# EAGLE design schemantic (EAGLE 9.5.0)
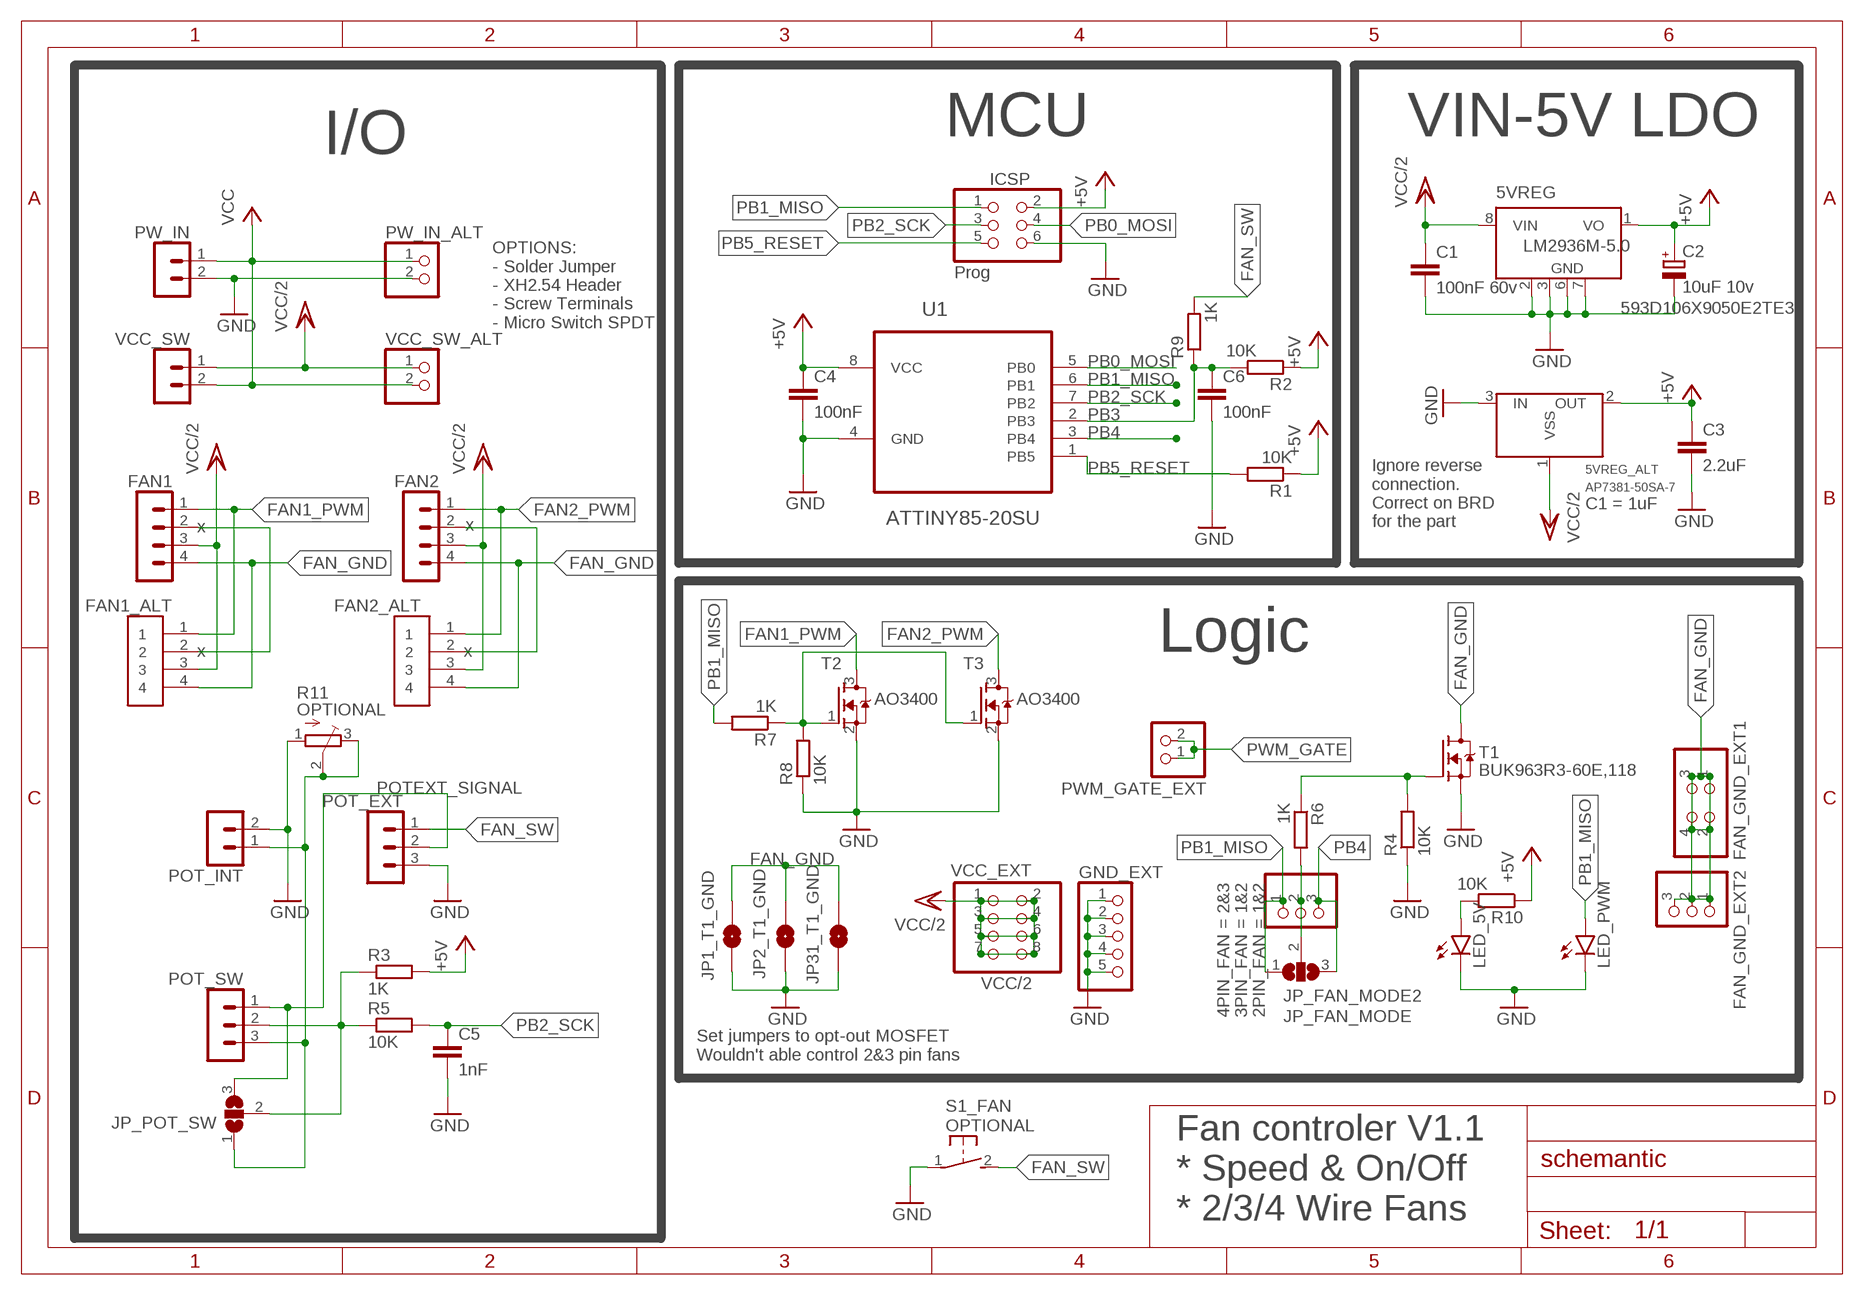
[diagram p0: schematic, sheet 1]

## Parts
5VREG  LM2936M-5.0  [SO08]
5VREG_ALT  AP7381-50SA-7  XC6206SOT-23  [XC6206_SOT-23]
C1  100nF 60v  C-EUC1206  [C1206]
C2  10uF 10v  CPOL-EUSMCE  [SMC_E]
C3  2.2uF  C-EUC0805  [C0805]
C4  100nF  C-EUC0805  [C0805]
C5  1nF  C-EUC0805  [C0805]
C6  100nF  C-EUC0805  [C0805]
FAN1  FAN1  B4P-VH  [B4P-VH]
FAN1_ALT  1X4-BIG  [1X04-BIG]
FAN2  FAN1  B4P-VH  [B4P-VH]
FAN2_ALT  1X4-BIG  [1X04-BIG]
FAN_GND_EXT1  PINHD-2X2  [2X02]
FAN_GND_EXT2  PINHD-1X3  [1X03]
GND_EXT  PINHD-1X5  [1X05]
ICSP  Prog  PINHD-2X3  [2X03]
JP1_T1_GND  JUMPER-SMT_2_NO_NO-SILK  [SMT-JUMPER_2_NO_NO-SILK]
JP2_T1_GND  JUMPER-SMT_2_NO_NO-SILK  [SMT-JUMPER_2_NO_NO-SILK]
JP31_T1_GND  JUMPER-SMT_2_NO_NO-SILK  [SMT-JUMPER_2_NO_NO-SILK]
JP_FAN_MODE  DC_COM_PWM  SJ2W  [SJ_2]
JP_FAN_MODE2  PINHD-1X3  [1X03]
JP_POT_SW  SJ2W  [SJ_2]
LED_5V  LEDCHIPLED_0805  [CHIPLED_0805]
LED_PWM  LEDCHIPLED_0805  [CHIPLED_0805]
POT_EXT  POT_EXT  B3B-XH-2  [B3B-XH-A]
POT_INT  POT_INT  B2B-XH-2  [B2B-XH-A]
POT_SW  POT_SW  B3B-XH-2  [B3B-XH-A]
PW_IN  Power In  B2P-VH  [B2P-VH]
PW_IN_ALT  PINHD-1X2  [1X02]
PWM_GATE_EXT  PINHD-1X2  [1X02]
R1  10K  R-EU_R0805  [R0805]
R2  10K  R-EU_R0805  [R0805]
R3  1K  R-EU_R0805  [R0805]
R4  10K  R-EU_R0805  [R0805]
R5  10K  R-EU_R0805  [R0805]
R6  1K  R-EU_R0805  [R0805]
R7  1K  R-EU_R0805  [R0805]
R8  10K  R-EU_R0805  [R0805]
R9  1K  R-EU_R0805  [R0805]
R10  10K  R-EU_R0805  [R0805]
R11  TRIM_EU-3223W  [3223W]
S1_FAN  DTSM-3  [DTSM-3]
T1  BUK963R3-60E,118  MOSFET-N-D2PAK  [D2PAK_TO263]
T2  AO3400  MOSFET-NREFLOW  [SOT23]
T3  AO3400  MOSFET-NREFLOW  [SOT23]
U1  ATTINY85-20SU  [SOIC127P798X216-8N]
VCC_EXT  PINHD-2X4  [2X04]
VCC_SW  Power SW  B2P-VH  [B2P-VH]
VCC_SW_ALT  PINHD-1X2  [1X02]

## Nets
+5V: 5VREG.1(VO) 5VREG_ALT.2(OUT) C2.+ C3.1 C4.1 ICSP.2 R1.1 R2.1 R3.2 R10.1 U1.8(VCC)
FAN1_LATCH: FAN1.2 FAN1_ALT.2
FAN1_PWM: FAN1.1 FAN1_ALT.1 T2.3(D)
FAN2_LATCH: FAN2.2 FAN2_ALT.2
FAN2_PWM: FAN2.1 FAN2_ALT.1 T3.3(D)
FAN_GND: FAN1.4 FAN1_ALT.4 FAN2.4 FAN2_ALT.4 FAN_GND_EXT1.1 FAN_GND_EXT1.2 FAN_GND_EXT1.3 FAN_GND_EXT1.4 FAN_GND_EXT2.1 FAN_GND_EXT2.2 FAN_GND_EXT2.3 JP1_T1_GND.2 JP2_T1_GND.2 JP31_T1_GND.2 T1.2(D)
FAN_SW: POT_EXT.1 R9.2 S1_FAN.2
GND: 5VREG.2(GND) 5VREG.3(GND) 5VREG.6(GND) 5VREG.7(GND) 5VREG_ALT.3(IN) C1.2 C2.- C3.2 C4.2 C5.2 C6.2 GND_EXT.1 GND_EXT.2 GND_EXT.3 GND_EXT.4 GND_EXT.5 ICSP.6 JP1_T1_GND.1 JP2_T1_GND.1 JP31_T1_GND.1 LED_5V.C LED_PWM.C POT_EXT.3 POT_INT.2 PW_IN.2 PW_IN_ALT.2 R4.1 R8.1 R11.1(A) S1_FAN.1 T1.3(S) T2.2(S) T3.2(S) U1.4(GND)
JP1_COM: JP_FAN_MODE2.2 JP_FAN_MODE.2 R6.2
LED1_ANODE: LED_5V.A R10.2
PB0_MOSI: ICSP.4 U1.5(PB0)
PB1_MISO: ICSP.1 JP_FAN_MODE2.1 JP_FAN_MODE.1 LED_PWM.A R7.2 U1.6(PB1)
PB2_SCK: C5.1 ICSP.3 R5.2 U1.7(PB2)
PB3: C6.1 R2.2 R9.1 U1.2(PB3)
PB4: JP_FAN_MODE2.3 JP_FAN_MODE.3 U1.3(PB4)
PB5_RESET: ICSP.5 R1.2 U1.1(PB5)
POTEXT_SIGNAL: JP_POT_SW.3 POT_EXT.2 POT_SW.1
POTINT_SIGNAL: JP_POT_SW.1 POT_INT.1 POT_SW.3 R11.2(S) R11.3(E)
POTSW_COM: JP_POT_SW.2 POT_SW.2 R3.1 R5.1
PWM_GATE: PWM_GATE_EXT.1 PWM_GATE_EXT.2 R7.1 R8.2 T2.1(G) T3.1(G)
T1_GATE: R4.2 R6.1 T1.1(G)
VCC: PW_IN.1 PW_IN_ALT.1 VCC_SW.2 VCC_SW_ALT.2
VCC/2: 5VREG.8(VIN) 5VREG_ALT.1(VSS) C1.1 FAN1.3 FAN1_ALT.3 FAN2.3 FAN2_ALT.3 VCC_EXT.1 VCC_EXT.2 VCC_EXT.3 VCC_EXT.4 VCC_EXT.5 VCC_EXT.6 VCC_EXT.7 VCC_EXT.8 VCC_SW.1 VCC_SW_ALT.1

## Notes on the sheet
- I/O | MCU | VIN-5V LDO
- OPTIONS:
  - Solder Jumper
  - XH2.54 Header
  - Screw Terminals
  - Micro Switch SPDT
- Ignore reverse
  connection.
  Correct on BRD
  for the part
- x | x
- Logic
- x | x
- Set jumpers to opt-out MOSFET
  Wouldn't able control 2&3 pin fans
- Fan controler V1.1
  * Speed & On/Off
  * 2/3/4 Wire Fans

## Library data of the parts
5VREG = national-semiconductor:LM2936M?*: Ultra-Low Quiescent Current LDO Voltage Regulator Source: Data sheet <http://www.national.com/ds/LM/LM2936.pdf>; MF: NATIONAL SEMICONDUCTOR; MPN: LM2936HVMA-5.0/NOPB; OC_FARNELL: 9494421; OC_NEWARK: 41K4515
5VREG_ALT = Voltage Regulator:XC6206: XC6206P , linear regulator. Producted by TOREX.Co Store Information: EXCEL device corporation http://www.excel-d.com/access/index.html; C1: 1uF
C1 C3-C6 = rcl:C-EU: CAPACITOR, European symbol; SPICEPREFIX: C
C2 = rcl:CPOL-EU: POLARIZED CAPACITOR, European symbol; MODEL: 593D106X9050E2TE3; SPICEPREFIX: C
FAN1 FAN2 = con-jst-vh:B4P-VH: JST VH Series header 3.96mm pitch disconnectable crimp style connectors, vertical (side entry type), 4 pins
FAN1_ALT FAN2_ALT = adafruit:1X4: 4-pin connector
FAN_GND_EXT1 = pinhead:PINHD-2X2: PIN HEADER
FAN_GND_EXT2 = pinhead:PINHD-1X3: PIN HEADER
GND_EXT = pinhead:PINHD-1X5: PIN HEADER
ICSP = pinhead:PINHD-2X3: PIN HEADER
JP1_T1_GND JP2_T1_GND JP31_T1_GND = SparkFun-Jumpers:JUMPER-SMT_2_NO: Normally open jumper This jumper has two pads in close proximity to each other. Apply solder to close the connection. Round pads are easier to solder for beginners, but are a lot larger. SparkFun Product that uses the round pads: SparkFun EL Sequencer <https://www.sparkfun.com/products/12781>
JP_FAN_MODE JP_POT_SW = jumper:SJ2W: SMD solder JUMPER
JP_FAN_MODE2 = adafruit:PINHD-1X3: PIN HEADER; 2PIN_FAN: 1&2; 3PIN_FAN: 1&2; 4PIN_FAN: 2&3
LED_5V LED_PWM = led:LED: LED OSRAM: - CHIPLED LG R971, LG N971, LY N971, LG Q971, LY Q971, LO R971, LY R971 LH N974, LH R974 LS Q976, LO Q976, LY Q976 LO Q996 - Hyper CHIPLED LW Q18S LB Q993, LB Q99A, LB R99A - SideLED LS A670, LO A670, LY A670, LG A670, LP A670 LB A673, LV A673, LT A673, LW A673 LH A674 LY A675 LS A676, LA A676, LO A676, LY A676, LW A676 LS A679, LY A679, LG A679 - Hyper Micro SIDELED® LS Y876, LA Y876, LO Y876, LY Y876 LT Y87S - SmartLED LW L88C, LW L88S LB L89C, LB L89S, LG L890 LS L89K, LO L89K, LY L89K LS L896, LA L896, LO L896, LY L896 - TOPLED LS T670, LO T670, LY T670, LG T670, LP T670 LSG T670, LSP T670, LSY T670, LOP T670, LYG T670 LG T671, LOG T671, LSG T671 LB T673, LV T673, LT T673, LW T673 LH T674 LS T676, LA T676, LO T676, LY T676, LB T676, LH T676, LSB T676, LW T676 LB T67C, LV T67C, LT T67C, LS T67K, LO T67K, LY T67K, LW E67C LS E67B, LA E67B, LO E67B, LY E67B, LB E67C, LV E67C, LT E67C LW T67C LS T679, LY T679, LG T679 LS T770, LO T770, LY T770, LG T770, LP T770 LB T773, LV T773, LT T773, LW T773 LH T774 LS E675, LA E675, LY E675, LS T675 LS T776, LA T776, LO T776, LY T776, LB T776 LHGB T686 LT T68C, LB T68C - Hyper Mini TOPLED® LB M676 - Mini TOPLED Santana® LG M470 LS M47K, LO M47K, LY M47K Source: http://www.osram.convergy.de LUXEON: - LUMILED® LXK2-PW12-R00, LXK2-PW12-S00, LXK2-PW14-U00, LXK2-PW14-V00 LXK2-PM12-R00, LXK2-PM12-S00, LXK2-PM14-U00 LXK2-PE12-Q00, LXK2-PE12-R00, LXK2-PE12-S00, LXK2-PE14-T00, LXK2-PE14-U00 LXK2-PB12-K00, LXK2-PB12-L00, LXK2-PB12-M00, LXK2-PB14-N00, LXK2-PB14-P00, LXK2-PB14-Q00 LXK2-PR12-L00, LXK2-PR12-M00, LXK2-PR14-Q00, LXK2-PR14-R00 LXK2-PD12-Q00, LXK2-PD12-R00, LXK2-PD12-S00 LXK2-PH12-R00, LXK2-PH12-S00 LXK2-PL12-P00, LXK2-PL12-Q00, LXK2-PL12-R00 Source: www.luxeon.com KINGBRIGHT: KA-3528ASYC Source: www.kingbright.com
POT_EXT POT_SW = con-jst-xh:B3B-XH: JST XH series header 2.50mm pitch disconnectable crimp style connectors, vertical (side entry type), 3 pins
POT_INT = con-jst-xh:B2B-XH: JST XH series header 2.50mm pitch disconnectable crimp style connectors, vertical (side entry type), 2 pins
PW_IN VCC_SW = con-jst-vh:B2P-VH: JST VH Series header 3.96mm pitch disconnectable crimp style connectors, vertical (side entry type), 2 pins
PW_IN_ALT PWM_GATE_EXT VCC_SW_ALT = pinhead:PINHD-1X2: PIN HEADER
R1-R10 = rcl:R-EU_: RESISTOR, European symbol; SPICEPREFIX: R
R11 = pot:TRIM_EU-: POTENTIOMETER; OPTIONAL: YES
S1_FAN = switch-tact:DTSM-3; OPTIONAL: YES
T1 = we-transistor:MOSFET-N: N-Channel MOSFET SOT23 N-Chn MOSFET TSM3404, TSM240N03 (Vgs>=+/-20V, Vds<=30V, Id>=3A + Rds<=0.05Ohm @ Vgs=4.5V) BSS138 (Vgs>=+/-20V, Vds<=40V, Id>=0.2A + Rds<=3Ohm @ Vgs=4.5V) SOT223 Low Side Switch with Protection (Infineon) BSP76 (Vin=0...10V, Vds<=42V, Id=1.4A + Rds=0.2Ohm @ Vin=5V) BSP77 (Vin=0...10V, Vds<=42V, Id=2.2A + Rds=0.1Ohm @ Vin=5V) D²Pak Low Side Switch with Protection (Infineon) BTS117TC (Vin=0...10V, Vds<=60V, Id=3.5A + Rds=0.12Ohm @ Vin=5V) BTS133TC (Vin=0...10V, Vds<=60V, Id=7A + Rds=0.06Ohm @ Vin=5V) BTS141TC (Vin=0...10V, Vds<=60V, Id=12A + Rds=0.03Ohm @ Vin=5V) BTS3018TC (Vin=0...10V, Vds<=60V, Id=6A + Rds=0.02Ohm @ Vin=5V); ALT1: IRF2805SPbF; OLD: SQM110P06-8m9L_GE3
T2 T3 = adafruit:MOSFET-N: N-Channel Mosfet 2N7002E - 60V 260mA SOT23 [Digikey: 2N7002ET1GOSTR-ND] - REEL BSH103 - 30V 850mA SOT23 [Digikey: 568-5013-1-ND]; SPICEPREFIX: J
U1 = Atmel_By_element14_Batch_1-00:ATTINY85-20SU: 8-bit Microcontroller with In-System Programmable Flash; MPN: ATTINY85-20SU; OC_FARNELL: 1455164; OC_NEWARK: 58M3797; PACKAGE: SOIC-8; SUPPLIER: Atmel
VCC_EXT = pinhead:PINHD-2X4: PIN HEADER

## Board
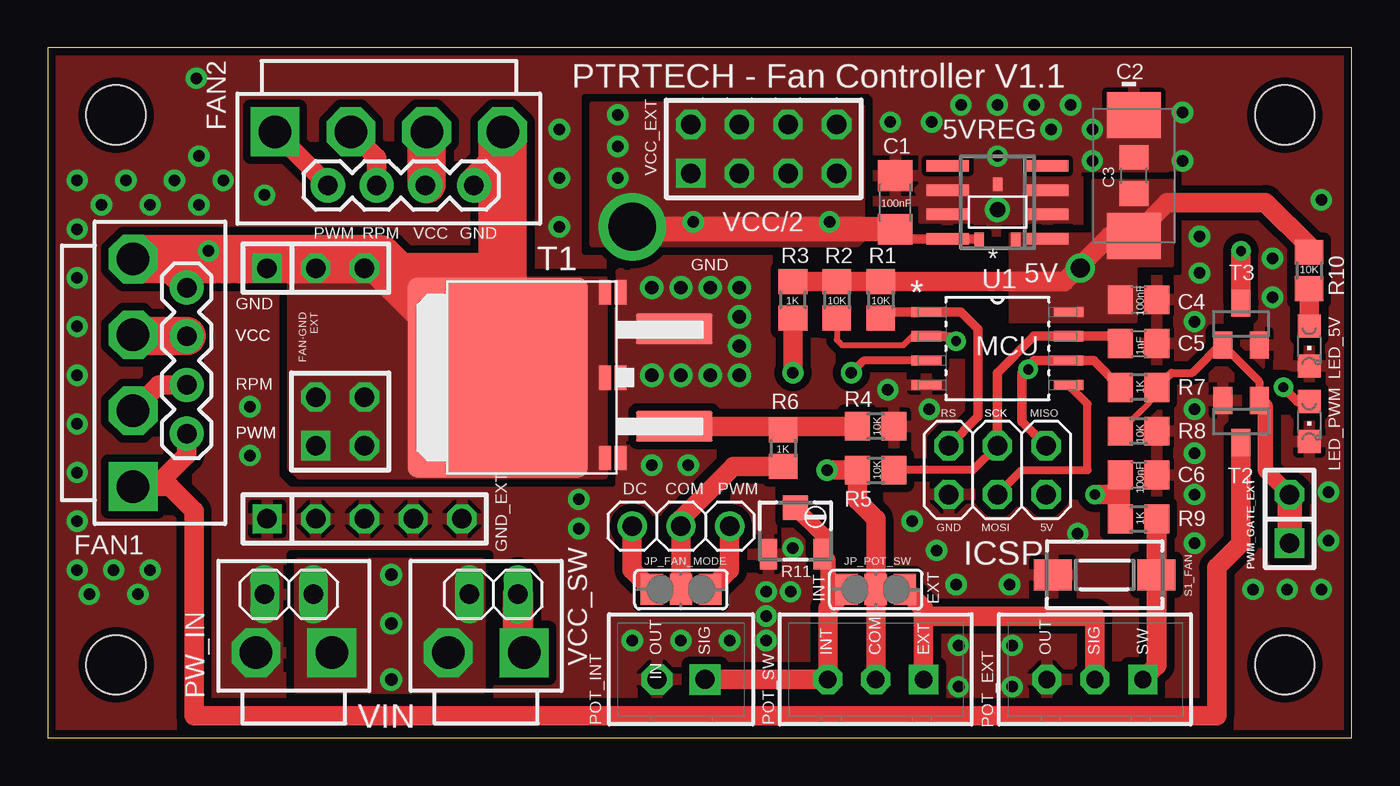
[diagram p1: board, top side]
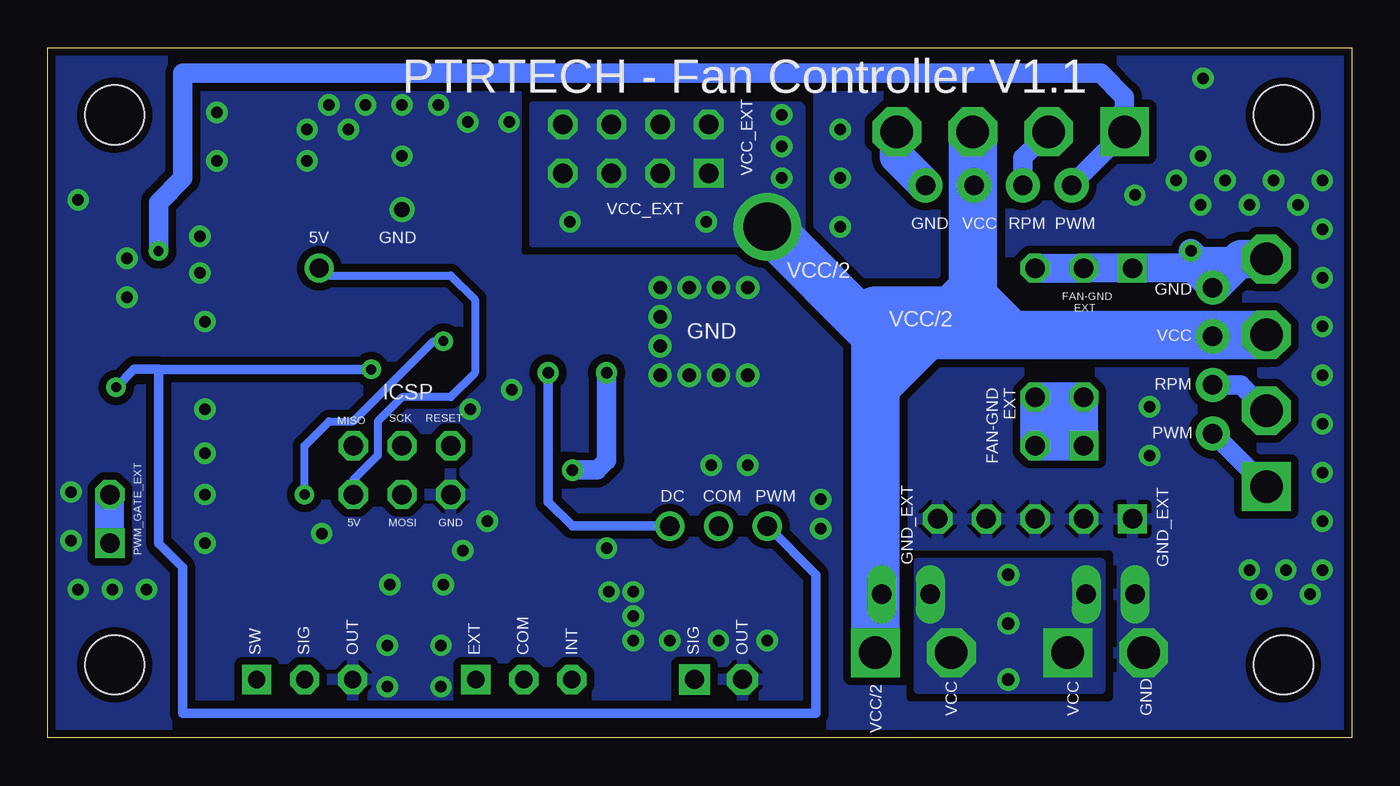
[diagram p2: board, bottom side, seen from below]

Size 68 x 36 mm. Coordinates in mm from the lower left corner, seen from the top.
Outline: 0,0 68,0 68,36 0,36 0,0
Copper layers (1*16): Top 0.035mm / dielectric 1.5mm / Bottom 0.035mm
Design rules "SparkFun-2-layer-STANDARD": minimum track width 10mil, minimum drill 20mil, track to track 10mil, track to pad 8mil, pad to pad 8mil, via to via 10mil, smd to smd 8mil, copper to edge 8mil, drill to drill 8mil, minimum pad ring 10mil, minimum via ring 10mil, stop-mask expansion 4mil, vias tented up to drill 25mil, thermal gap 10mil
Holes 3.1 mm at 3.56,3.81 3.56,32.5 64.52,3.81 64.52,32.5

### Footprints (pad centres in the part's own frame; a part is rotated, then mirrored left to right if it is on the bottom)
SO08 = smd 0.6 x 2.2: 1 -1.905,-2.6; 2 -0.635,-2.6; 3 0.635,-2.6; 4 1.905,-2.6; 5 1.905,2.6; 6 0.635,2.6; 7 -0.635,2.6; 8 -1.905,2.6
XC6206_SOT-23 = smd 0.5 x 0.7: 1 -0.95,-1.415; 2 0.95,-1.415; 3 0,1.44
C1206 = smd 1.6 x 1.8: 1 -1.4,0; 2 1.4,0
SMC_E = smd 2.4 x 2.8: + -3.15,0; - 3.15,0
C0805 = smd 1.3 x 1.5: 1 -0.95,0; 2 0.95,0
B4P-VH = drill 1.7 pad 2.54 square: 1 -5.94,0 | drill 1.7 pad 2.54 octagon: 2 -1.98,0; 3 1.98,0; 4 5.94,0
1X04-BIG = drill 1.016 pad 1.778: 1 0,0; 2 2.54,0; 3 5.08,0; 4 7.62,0
2X02 = drill 1.016 square: 1 -1.27,-1.27 | drill 1.016 octagon: 2 -1.27,1.27; 3 1.27,-1.27; 4 1.27,1.27
1X03 = drill 1.016 square: 1 -2.54,0 | drill 1.016 octagon: 2 0,0; 3 2.54,0
1X05 = drill 1.016 square: 1 -5.08,0 | drill 1.016 octagon: 2 -2.54,0; 3 0,0; 4 2.54,0; 5 5.08,0
2X03 = drill 1.016 octagon: 1 -2.54,-1.27; 2 -2.54,1.27; 3 0,-1.27; 4 0,1.27; 5 2.54,-1.27; 6 2.54,1.27
SMT-JUMPER_2_NO_NO-SILK = smd 0.635 x 1.27: 1 -0.406,0; 2 0.406,0
SJ_2 = smd 1.168 x 1.6: 1 -1.524,0; 2 0,0; 3 1.524,0
1X03' = drill 1.016: 1 -2.54,0; 2 0,0; 3 2.54,0
CHIPLED_0805 = smd 1.2 x 1.2: A 0,-1.05; C 0,1.05
B3B-XH-A = drill 0.9 pad 1.524 square: 1 2.5,0 | drill 0.9 pad 1.524 octagon: 2 0,0; 3 -2.5,0
B2B-XH-A = drill 1 pad 1.6 square: 1 1.25,0 | drill 1 pad 1.6 octagon: 2 -1.25,0
B2P-VH = drill 1.7 pad 2.54 square: 1 -1.98,0 | drill 1.7 pad 2.54 octagon: 2 1.98,0
1X02 = drill 1.016 long: 1 -1.27,0; 2 1.27,0
1X02' = drill 1.016 square: 1 -1.27,0 | drill 1.016 octagon: 2 1.27,0
R0805 = smd 1.3 x 1.5: 1 -0.95,0; 2 0.95,0
3223W = smd 0.9 x 1.6: 1 -1.4,-1.215; 3 1.4,-1.215 | smd 1.3 x 1.3: 2 0,1.215
DTSM-3 = smd 2 x 1.6: 1 -2.7,0; 2 2.7,0
D2PAK_TO263 = smd 4 x 1.6: 1 -6,2.54; 3 -6,-2.54 | smd 9.4 x 10.4: 2 3.2,0
SOT23 = smd 1 x 1.4: 1 -0.95,-1.1; 2 0.95,-1.1; 3 0,1.1
SOIC127P798X216-8N = smd 1.549 x 0.533: 1 -3.708,1.905; 2 -3.708,0.635; 3 -3.708,-0.635; 4 -3.708,-1.905; 5 3.708,-1.905; 6 3.708,-0.635; 7 3.708,0.635; 8 3.708,1.905
2X04 = drill 1.016 square: 1 -3.81,-1.27 | drill 1.016 octagon: 2 -3.81,1.27; 3 -1.27,-1.27; 4 -1.27,1.27; 5 1.27,-1.27; 6 1.27,1.27; 7 3.81,-1.27; 8 3.81,1.27

### Placement (x,y rotation side)
5VREG  49.53,27.94 90 top
5VREG_ALT  49.53,27.43 0 top
C1  44.2,27.94 90 top
C2  56.64,29.34 90 top
C3  56.64,29.34 90 top
C4  56.9,22.86 0 top
C5  56.9,20.57 0 top
C6  56.9,13.72 0 top
FAN1  4.45,19.05 90 top
FAN1_ALT  7.24,15.88 90 top
FAN2  17.78,31.62 0 top
FAN2_ALT  14.61,28.83 0 top
FAN_GND_EXT1  15.24,16.51 0 top
FAN_GND_EXT2  13.97,24.51 0 top
GND_EXT  16.51,11.43 0 top
ICSP  49.53,13.97 180 top
JP1_T1_GND  29.46,18.8 180 top
JP2_T1_GND  29.46,14.61 180 top
JP31_T1_GND  29.46,23.24 180 top
JP_FAN_MODE  33.02,7.75 0 top
JP_FAN_MODE2  [1X03']  33.02,11.05 0 top
JP_POT_SW  43.18,7.75 0 top
LED_5V  65.79,20.45 180 top
LED_PWM  65.79,16.51 180 top
POT_EXT  54.61,3.05 0 top
POT_INT  33.02,3.05 0 top
POT_SW  43.18,3.05 0 top
PW_IN  12.83,4.45 180 top
PW_IN_ALT  12.57,7.49 180 top
PWM_GATE_EXT  [1X02']  64.77,11.43 90 top
R1  43.43,22.86 270 top
R2  41.15,22.86 270 top
R3  38.86,22.86 90 top
R4  43.18,16.26 180 top
R5  43.18,13.97 0 top
R6  38.35,15.11 270 top
R7  56.9,18.29 180 top
R8  56.9,16 180 top
R9  56.9,11.43 0 top
R10  65.79,24.38 270 top
R11  38.99,10.79 0 top
S1_FAN  55.12,8.51 0 top
T1  26.67,18.8 180 top
T2  62.23,16.51 180 top
T3  62.23,21.59 0 top
U1  49.53,20.32 0 top
VCC_EXT  37.34,30.73 0 top
VCC_SW  22.86,4.45 180 top
VCC_SW_ALT  23.24,7.49 180 top

### Tracks (layer width: path | path; a pad name or v marks a point on that pad's centre or on a via)
+5V  (via drill 1)
  Top 1.016: R1.1 53.02,23.81 55.4,26.19 C2.+ 58.4,27.94 63.5,27.94 65.79,25.65 R10.1 | R3.2 R1.1 | R2.1 R1.1
  Bottom 0.406: ICSP.2 52.07,13.46 50.8,14.73 50.8,16.51 49.53,17.78 46.99,17.78 45.72,19.05 45.72,22.86 46.99,24.13 53.47,24.13
  Bottom 0.508: v53.85,24.51 53.47,24.13
  pour Top (rank 5, no thermals): 56.77,21.72 56.77,24.64 58.67,24.64 58.67,29.08 54.48,29.08 54.48,26.29 50.16,26.29 50.16,21.72
FAN1_LATCH
  Top 1.016: FAN1.2 5.79,18.41 FAN1_ALT.2
  Bottom 1.016: FAN1.2 5.79,18.41 FAN1_ALT.2
FAN1_PWM
  Top 1.016: 5.59,13.11 6.35,13.11 7.62,11.84 7.62,1.14 60.96,1.14 60.96,8.89 62.23,10.16 T2.3 | 5.59,13.11 FAN1.1 | FAN1_ALT.1 7.24,14.76 5.59,13.11
  Bottom 1.016: FAN1.1 7.21,15.88 FAN1_ALT.1
FAN2_LATCH
  Top 1.016: FAN2_ALT.2 17.14,30.28 FAN2.2
  Bottom 1.016: FAN2.2 17.14,30.28 FAN2_ALT.2
FAN2_PWM  (via drill 0.51)
  Top 1.016: T3.3 v62.23,25.4 | FAN2_ALT.1 11.84,31.59 FAN2.1
  Bottom 1.016: v62.23,25.4 62.23,27.94 60.96,29.21 60.96,34.67 13.08,34.67 11.84,33.43 FAN2.1 11.84,31.59 FAN2_ALT.1
FAN_GND  (via drill 0.6)
  Top 1.27: FAN1_ALT.4 5.74,24.99 FAN1.4
  Top 1.8: FAN2_ALT.4 23.72,30.32 FAN2.4
  Top 2: 17.96,24.31 23.54,24.31 23.72,24.13
  Top 2.54: 22.45,19.82 T1.2 | T1.2 17.96,24.31 17.28,24.99 14.85,24.99 14.83,24.97 | 14.83,24.97 8.89,24.97 8.87,24.99 FAN1.4 14.81,24.99 14.83,24.97 | T1.2 23.72,19.05 23.72,24.13 FAN2.4
  Bottom 1.016: v8.38,25.4 8.38,24.64 8.26,24.51
  Bottom 1.27: FAN1.4 7.97,24.99 v8.38,25.4
  Bottom 1.5: FAN_GND_EXT2.3 FAN_GND_EXT2.2 FAN_GND_EXT2.1 8.26,24.51 FAN1_ALT.4 | FAN_GND_EXT1.2 FAN_GND_EXT1.4 FAN_GND_EXT1.3 | FAN_GND_EXT1.3 FAN_GND_EXT1.1 FAN_GND_EXT1.2 | FAN_GND_EXT1.2 FAN_GND_EXT1.3
  Bottom 1.8: FAN1_ALT.4 5.74,24.99 | FAN2_ALT.4 23.72,30.32 FAN2.4
  Bottom 2: 5.74,24.99 FAN1.4
  pour Top (isolate 0.305, rank 5, no thermals): 12.57,24 29.08,24 29.08,13.59 13.08,13.59 12.57,14.1
FAN_SW
  Top 1.016: R9.2 57.85,3.78 POT_EXT.1 57.82,3.76 S1_FAN.2 57.82,11.4 R9.2
GND  (via drill 0.6, 0.7, 0.8)
  other vias: 45.09,11.3 43.81,18.16 49.53,27.56 26.67,31.75 43.94,32.13 30.48,5.08 33.02,5.08 36.07,21.97 1.52,13.84 59.82,12.7 59.82,21.72 59.82,10.16 59.82,14.86 52.32,31.75 54.48,30.1 59.18,30.1 45.97,17.14 35.56,5.08 37.47,5.08 1.52,16.38 1.52,18.92 1.52,21.46 1.52,24 47.5,2.67 59.82,17.14 53.72,10.67 46.35,9.78 1.52,26.54 1.52,29.08 4.06,29.08 6.6,29.08 1.52,11.3 1.52,8.76 5.33,8.76 49.53,30.35 60.07,24.26 26.67,29.21 9.14,29.08 7.87,27.81 5.33,27.81 2.79,27.81 33.02,18.92 31.5,18.92 34.54,18.92 7.87,30.35 10.54,17.27 10.54,14.73 59.18,32.64 63.88,22.99 63.88,25.02 66.8,12.83 66.8,10.29 66.42,7.75 62.87,7.75 66.42,28.07 60.07,26.16 26.67,26.67 46.1,32.13 11.3,28.32 36.07,18.92 31.5,23.5 33.02,23.5 34.54,23.5 36.07,23.5 36.07,20.45 50.16,8 47.37,8 47.5,4.83 50.29,4.83 50.29,2.67 27.69,10.92 31.5,14.22 33.4,14.22 27.69,12.45 37.47,6.35 37.47,7.62 38.73,7.62 38.86,9.91 7.75,34.42 3.43,8.76 64.64,7.75 2.16,7.49 4.7,7.49 47.62,33.02 51.44,33.02 49.53,33.02 53.34,33.02 54.48,31.75
  pour Top (isolate 0.406, rank 6): -0.64,36.83 68.71,36.83 68.71,-0.89 -0.64,-0.89
  pour Bottom (isolate 0.406, rank 6): -1.65,37.97 69.85,37.97 69.85,-2.03 -1.65,-2.03
  pour Top (rank 5, no thermals): 45.47,32.26 45.47,26.92 53.85,26.92 53.85,29.59 58.42,29.59 58.42,32.26
  pour Top (no thermals): 9.02,9.14 12.06,9.14 12.06,2.54 9.02,2.54
  pour Bottom (no thermals): 9.02,9.14 12.06,9.14 12.06,2.54 9.02,2.54
  pour Top (no thermals): 29.84,24.13 36.83,24.13 36.83,17.91 29.84,17.91
  pour Top (isolate 0.406, no thermals): 29.72,13.72 29.72,15.11 31.62,15.11 31.62,13.72
JP1_COM
  Top 1.016: JP_FAN_MODE.2 JP_FAN_MODE2.2 33.02,11.43 35.75,14.16 R6.2
LED1_ANODE
  Top 1.016: R10.2 LED_5V.A
PB0_MOSI
  Top 0.406: ICSP.4 50.8,13.97 54.23,13.97 54.23,17.42 U1.5
PB1_MISO  (via drill 0.51)
  Top 0.406: U1.6 51.6,19.68 v51.14,19.22
  Top 0.508: R7.2 54.55,19.68 U1.6 51.44,19.68 50.8,19.05 50.8,16.51 ICSP.1 | LED_PWM.A 65.17,17.56 v64.44,18.29
  Top 1.016: JP_FAN_MODE.1 30.48,8.76 JP_FAN_MODE2.1
  Bottom 0.508: 62.23,19.24 62.23,10.16 60.96,8.89 60.96,1.27 27.94,1.27 27.94,8.51 JP_FAN_MODE2.1 | v51.14,19.22 62.21,19.22 62.23,19.24 | 62.23,19.24 63.49,19.24 v64.44,18.29
PB2_SCK
  Top 0.406: ICSP.3 48.26,13.97 R5.2
  Top 0.508: ICSP.3 49.53,19.05 51.44,20.95 U1.7 55.56,20.95 C5.1
PB3  (via drill 0.51)
  Top 0.305: R2.2 41.15,20.77 41.44,20.47 44.6,20.47 45.09,20.95 U1.2
  Top 0.406: U1.2 47.12,20.95 v47.37,20.7
  Top 1.016: C6.1 55.95,12.7 | 55.95,12.7 R9.1 | v54.61,12.7 55.95,12.7
  Bottom 0.406: v47.37,20.7 47.88,20.7 52.07,16.51 53.34,16.51 54.61,15.24 v54.61,12.7
PB4  (via drill 0.6)
  Top 0.406: U1.3 42.55,19.68 v41.91,19.05
  Top 1.016: JP_FAN_MODE2.3 35.56,8.76 JP_FAN_MODE.3
  Bottom 0.508: v41.91,19.05 41.91,12.32 40.64,11.05 JP_FAN_MODE2.3
PB5_RESET
  Top 0.508: R1.2 43.75,22.23 U1.1 47.62,22.23 48.51,21.34 48.51,16.76 ICSP.5
POTEXT_SIGNAL
  Top 1.016: JP_POT_SW.3 45.68,6.77 45.68,6.35 | 45.68,6.35 POT_SW.1 | POT_EXT.2 54.61,6.35 45.68,6.35
POTINT_SIGNAL
  Top 0.813: R11.2 40.39,10.61 R11.3 40.68,9.29 40.68,6.35
  Top 1.016: JP_POT_SW.1 40.68,6.77 40.68,6.35 POT_SW.3 POT_INT.1
POTSW_COM  (via drill 0.6)
  Top 1.016: R3.1 v38.86,19.05 | v40.64,13.97 R5.1 42.23,12.38 43.18,11.43 JP_POT_SW.2 POT_SW.2
  Bottom 1.016: v38.86,19.05 38.86,14.48 39.37,13.97 v40.64,13.97
PWM_GATE
  Top 0.305: 57.88,18.32 57.88,17.93 57.05,17.11 56.84,16.9 R8.2
  Top 0.406: T2.1 63.18,18.59 T3.1 61.32,20.49 61.32,20.68 59.69,19.05 58.61,19.05 57.88,18.32 R7.1
  Top 0.813: PWM_GATE_EXT.2 63.5,13.97 63.5,17.29 T2.1
  Top 1.27: PWM_GATE_EXT.1 PWM_GATE_EXT.2
  Bottom 1.5: PWM_GATE_EXT.1 PWM_GATE_EXT.2
T1_GATE
  Top 1.016: 38.35,16.26 T1.1 | 38.35,16.26 R4.2 | R6.1 38.35,16.26
VCC  (via drill 0.65)
  other vias: 17.91,8.51 17.91,3.05 17.91,5.97
  pour Top (isolate 0.406, rank 5, no thermals): 13.08,9.14 13.08,2.54 22.61,2.54 22.61,9.14
  pour Bottom (isolate 0.406, rank 5, no thermals): 13.08,9.14 13.08,2.54 22.61,2.54 22.61,9.14
VCC/2  (via drill 0.6, 2.5)
  Top 0.508: C1.1 44.7,26.04 5VREG.8 48.56,26.04 5VREG_ALT.1
  Top 1.27: C1.1 30.48,26.54 v30.48,26.67 | 19.76,28.9 FAN2_ALT.3
  Top 1.6: VCC_SW_ALT.1 24.51,4.77
  Top 1.8: 24.51,4.77 VCC_SW.1
  Top 2: FAN2.3 19.76,28.9 | FAN1_ALT.3 4.52,20.95 FAN1.3
  Bottom 2.54: 24.84,18.34 22.15,21.03 | FAN1.3 17.78,21.03 | 17.78,21.03 20.32,21.03 | 20.32,21.03 22.15,21.03 | 22.15,21.03 19.76,23.42 FAN2.3 19.76,23.01 17.78,21.03 | VCC_SW.1 24.84,18.34 | 24.84,21.03 24.84,22.3 21.59,22.3 20.32,21.03 | 24.84,21.03 24.84,18.34 | v30.48,26.67 24.84,21.03
  other vias: 29.72,29.21 29.72,32.51 29.72,30.86 33.66,26.92 40.77,26.92
  pour Top (isolate 0.305, no thermals): 28.45,33.02 42.29,33.02 42.42,32.89 42.42,26.04 42.16,25.78 28.45,25.78
  pour Bottom (isolate 0.305, no thermals): 42.67,33.02 28.83,33.02 28.7,32.89 28.7,26.04 28.96,25.78 42.67,25.78

### Text on the board
tNames: PTRTECH - Fan Controller V1.1 | - | 100nF | PWM | RPM | VCC | GND | VCC/2 | * | 10K | GND | 5V | 100nF | 1K | 10K | 10K | GND | FAN-GND / EXT | VCC | VCC | 1nF | MCU | 1K | RPM | 10K | RS | SCK | SCK | MISO | PWM | PWM | 10K | 1K | 10K | 100nF | DC COM PWM | 1K | GND | MOSI | 5V | INT | EXT | OUT | SIG | INT | COM | EXT | OUT | SIG | SW | IN | VIN
bNames: PTRTECH - Fan Controller V1.1 | VCC_EXT | PWM | RPM | VCC | GND | VCC_EXT | GND | 5V | VCC/2 | GND | FAN-GND / EXT | VCC | VCC/2 | GND | RPM | FAN-GND / EXT | ICSP | RESET | SCK | MISO | PWM | GND_EXT | GND_EXT | DC COM PWM | GND | MOSI | 5V | PWM_GATE_EXT | OUT | SIG | INT | COM | EXT | OUT | SIG | SW | GND | VCC | VCC | VCC/2